# Altium project Kicker_Module_2018.PrjPcb
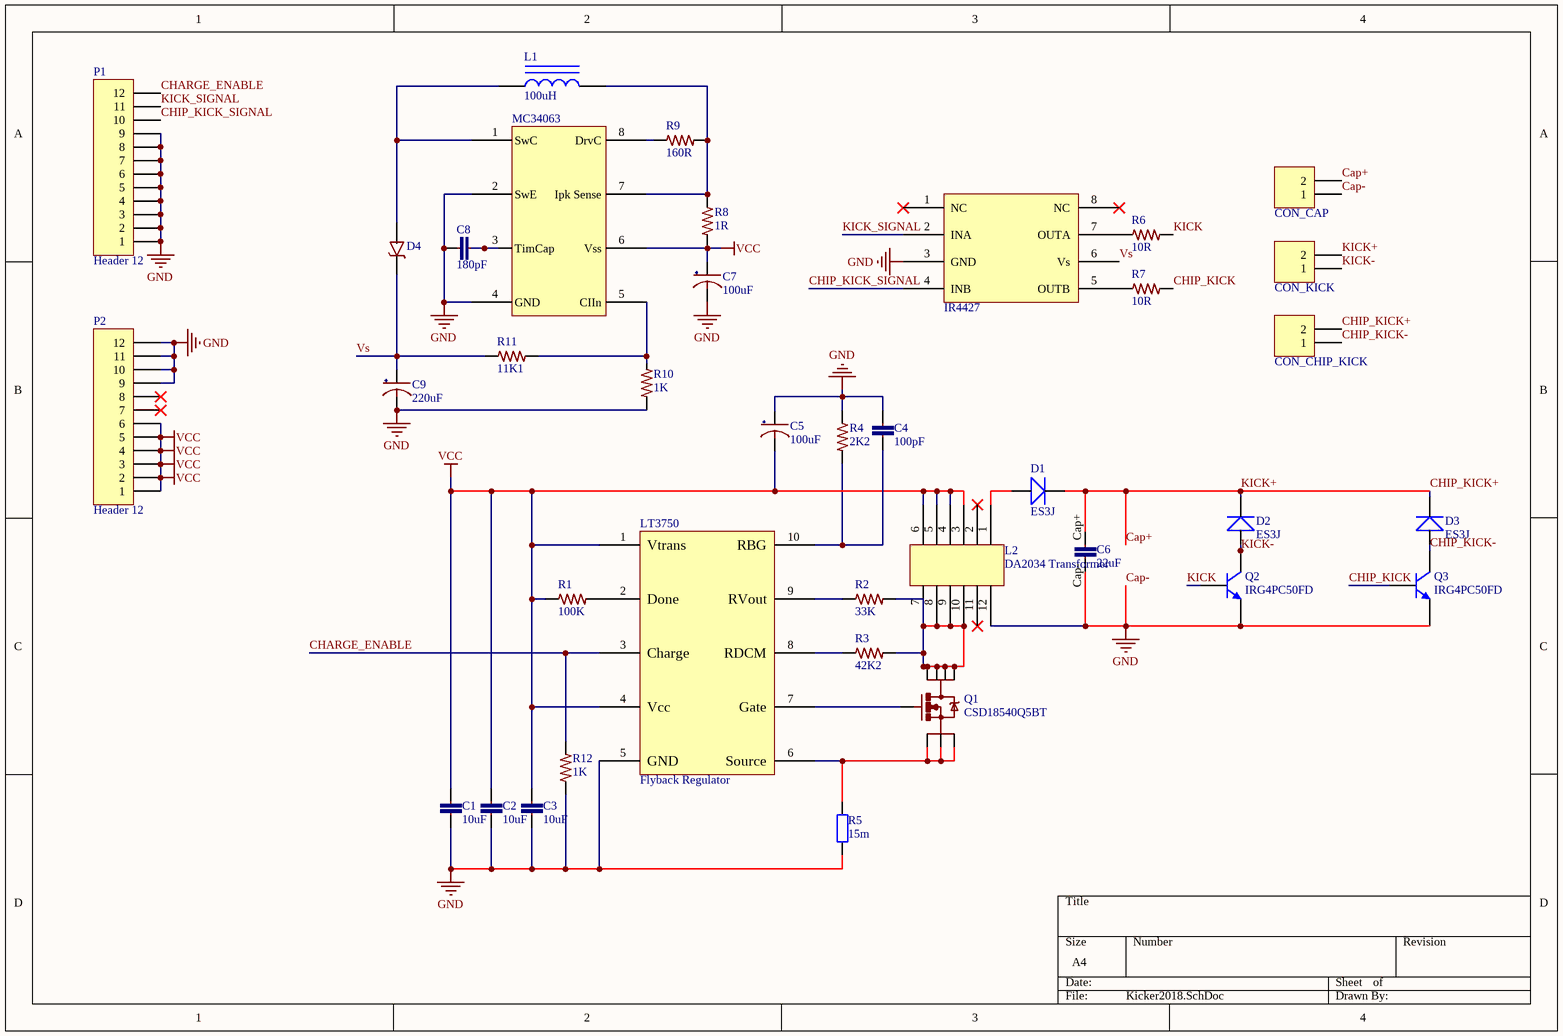
[diagram p0: Kicker2018.SchDoc]
1 sheet, 38 parts. Net scope: global (net labels, ports and power ports of the same name join across sheets).
Board file: Kicker2018_PCB.PcbDoc

## Sheet Kicker2018.SchDoc
size A4

### Parts
C1  10uF  [CAPC0603(1608)55_L]
C2  10uF  [CAPC0603(1608)55_L]
C3  10uF  [CAPC0603(1608)55_L]
C4  100pF  [CAPC0603(1608)55_L]
C5  100uF  [PCBComponent]
C6  22uF  [CAP ALUM 22UF 250V]
C7  100uF  [7343-CAPPOL]
C8  180pF  [0805-CAP]
C9  220uF  [NIC-CAPA2-10X10_V]
CON_CAP  OSTTA024163  [Term Block 2P]  (value not drawn)
CON_CHIP_KICK  OSTTA024163  [Term Block 2P]  (value not drawn)
CON_KICK  OSTTA024163  [Term Block 2P]  (value not drawn)
D1  ES3J  [Diode]
D2  ES3J  [Diode]
D3  ES3J  [Diode]
D4  DIODE SCHOTTKY 60V 30A D2PAK  [DPAK254P1542X460-3N]  (value not drawn)
IR4427  GATE DRIVER  [IR4427]  (value not drawn)
L1  100uH  [INDUCTOR]
L2  DA2034 Transformer  [DA2034 Transformer]
LT3750  Flyback Regulator  [LT3750]
MC34063  Switching Voltage Regulator  [MC34063]  (value not drawn)
P1  Header 12  [HDR1X12]
P2  Header 12  [HDR1X12]
Q1  CSD18540Q5BT  [PCBComponent]
Q2  IRG4PC50FD  [IRG4PC50FD]
Q3  IRG4PC50FD  [IRG4PC50FD]
R1  100K  [0402-RES-HD]
R2  33K  [0402-RES-HD]
R3  42K2  [0402-RES-HD]
R4  2K2  [0402-RES-HD]
R5  15m  [RES1206]
R6  10R  [0402-RES-HD]
R7  10R  [0402-RES-HD]
R8  1R  [0805-RES]
R9  160R  [0805-RES]
R10  1K  [0402-RES-HD]
R11  11K1  [0402-RES-HD]
R12  1K  [0402-RES-HD]

### Nets
Cap-: C1.2 C2.2 C3.2 C4.1 C5.1(+) C6.Cap- C7.2(-) C8.1 C9.2(-) CON_CAP.1 IR4427.3(GND) L2.12 LT3750.5(GND) MC34063.2(SwE) MC34063.4(GND) P1.1 P1.2 P1.3 P1.4 P1.5 P1.6 P1.7 P1.8 P1.9 P2.9 P2.10 P2.11 P2.12 Q2.3(E) Q3.3(E) R4.2 R5.2 R10.1 R12.1  [also labelled GND]
VCC: C1.1 C2.1 C3.1 C5.2(-) C7.1(+) L2.3 L2.4 L2.5 L2.6 LT3750.1(Vtrans) LT3750.4(Vcc) MC34063.6(Vss) P2.1 P2.2 P2.3 P2.4 P2.5 P2.6 R1.1 R8.1
Cap+: C6.Cap+ CON_CAP.2 CON_CHIP_KICK.2 CON_KICK.2 D1.D1+ D2.D1+ D3.D1+  [also labelled CHIP_KICK+, KICK+]
CHARGE_ENABLE: LT3750.3(Charge) P1.12 R12.2
CHIP_KICK: Q3.2(G) R7.2
CHIP_KICK-: CON_CHIP_KICK.1 D3.D1- Q3.1(C)
CHIP_KICK_SIGNAL: IR4427.4(INB) P1.10
KICK: Q2.2(G) R6.2
KICK-: CON_KICK.1 D2.D1- Q2.1(C)
KICK_SIGNAL: IR4427.2(INA) P1.11
Vs: C9.1(+) D4.K IR4427.6(Vs) R11.1
NetC4_2: C4.2 LT3750.10(RBG) R4.1
NetC8_2: C8.2 MC34063.3(TimCap)
NetD1_D1-: D1.D1- L2.1
NetD4_A: D4.A L1.1 MC34063.1(SwC)
NetIR4427_5: IR4427.5(OUTB) R7.1
NetIR4427_7: IR4427.7(OUTA) R6.1
NetL1_2: L1.2 MC34063.7(Ipk_Sense) R8.2 R9.2
NetL2_7: L2.7 L2.8 L2.9 L2.10 Q1.5(D) Q1.6(D) Q1.7(D) Q1.8(D) R2.2 R3.2
NetLT3750_2: LT3750.2(Done) R1.2
NetLT3750_6: LT3750.6(Source) Q1.1(S) Q1.2(S) Q1.3(S) R5.1
NetLT3750_7: LT3750.7(Gate) Q1.4(G)
NetLT3750_8: LT3750.8(RDCM) R3.1
NetLT3750_9: LT3750.9(RVout) R2.1
NetMC34063_5: MC34063.5(CIIn) R10.2 R11.2
NetMC34063_8: MC34063.8(DrvC) R9.1

Not connected (* = marked no-connect by the designer): IR4427 1(NC)* 8(NC)*; L2 2* 11*; P2 7* 8*

### Library data of the parts
C1-C3 = C0603-10uF-16V-1: CAP CER 10UF 16V X5R 0603; Part No: EMK107BBJ106MA-T; Cod EMS: 05.281.019.592; Value: 10uF
C4 = CC0603--1: CAP CER 100PF 50V NP0 0603; Part No: GRM1885C1H101JA01D; Value: 100pF
C5 = CA-100uF-3: CAP ALUM 100UF 20% 80V SMD
C6 = CAP ALUM 22UF 250V
C7 = CT2917-100uF-1: CAP TANT 100uF 25V 20% ESR = 30mOhm @ 100 kHz; Part No: T521X107M025ATE030
C8 = CC0805-180pF-2: CAP CER 180PF 50V NP0 0805; Part No: C0805C181K5GACTU; Cod EMS: 05.281.019.399; Value: 180pF
C9 = CA-220uF-1: CAP ALUM 220uF 20% 50V  ESR = 0,18 ohms  Radial DIA 10mm HEIGH 10,2mm; Part No: EEEFK1H221P; Cod EMS: 05.281.030.094; Value: 220uF
CON_CAP CON_CHIP_KICK CON_KICK = Term Block 2P: 2 Position Wire to Board Terminal Block Horizontal with Board 0.200" (5.08mm) Through Hole
D4 = STPS30M60SG-TR-1: Part No: STPS30M60SG-TR
IR4427 = IR4427: IC DRIVER DUAL LOW SIDE 8-SOIC
L1 = Inductor: Fixed Inductors 100uH 0.86A SMT
LT3750 = LT3750
MC34063 = MC34063
P1 P2 = Header 12: Header, 12-Pin; LatestRevisionDate: 17-Jul-2002; LatestRevisionNote: Re-released for DXP Platform.; Publisher: Altium Limited
Q1 = CSD18540Q5BT-1: MOSFET N-CH 60V 100A 8VSON; Part No: CSD18540Q5BT
Q2 Q3 = IRG4PC50FD: IGBT Transistors 600V FAST 1-8 KHZ COPACK IGBT; Published: 28-dez-2017; DatasheetVersion: 2000; Publisher: RoboIME; ComponentLink2URL: http://www.irf.com/product-info/datasheets/data/irg4pc50fd.pdf
R1 = R0402-100K-11: RES 100K OHM 1/10W 1% 0402 SMD 1; Part No: ERJ-2GEJ104X; Cod EMS: 05.280.029.504; Family Description: RESISTOR FILME ESPESSO 0R-1M / 1/10W / 5% /  0402. P/N: ERJ-2GE....X – PANASONIC ELECTRONIC COMPONENTS.; Family: ERJ-2GE....X; Value: 100k
R2 = R0402-33K-7: RES 33K OHM 1/10W 1% 0402 SMD; Part No: ERJ-2RKF3302X; Cod EMS: 05.280.029.535; Family Description: RESISTOR FILME ESPESSO 10R-1M / 1/10W / 1% / 0402. P/N: ERJ-2RKF....X – PANASONIC ELECTRONIC COMPONENTS.; Value: 33K; Family: ERJ-2RKF....X
R3 = RESISTOR: RES 42.2K OHM 1/10W 1% 0402 SMD; Part No: ERJ-2RKF4222X; Value: 42.2K
R4 = R0402-2K2-5: RES 2.2K OHM 1/10W 1% 0402 SMD; Part No: ERJ-2RKF2201X; Cod EMS: 05.280.029.541; Family Description: RESISTOR FILME ESPESSO 10R-1M / 1/10W / 1% / 0402. P/N: ERJ-2RKF....X – PANASONIC ELECTRONIC COMPONENTS.; Value: 2.2K; Family: ERJ-2RKF....X
R5 = Res2: Resistor; Published: 8-Jun-2000; LatestRevisionDate: 17-Jul-2002; LatestRevisionNote: Re-released for DXP Platform.; PackageReference: AXIAL-0.4; Publisher: Altium Limited; PackageDescription: Axial Device, Thru-Hole; 2 Leads; 0.4 in Pin Spacing; Value: 15m
R6 R7 = R0402-10R-6: RES 10 OHM 1/10W 1% 0402 SMD; Part No: ERJ-2RKF10R0X; Cod EMS: 05.280.029.523; Value: 10; Family Description: RESISTOR FILME ESPESSO 10R-1M / 1/10W / 1% / 0402. P/N: ERJ-2RKF....X – PANASONIC ELECTRONIC COMPONENTS.; Family: ERJ-2RKF....X
R8 = R0805-1R-1%-1: RES SMD 1 OHM 1% 1/8W 0805; Part No: CRCW08051R00FKEA; Cod EMS: 05.280.029.391; Value: 1R
R9 = R0805-160R-5: RES 160 OHM 1/8W .5% 0805 SMD; Part No: ERA-6AED161V; Cod EMS: 05.280.029.516; Value: 160; Family: ERA-6AED...V
R10 R12 = R0402-1K-A.9: RES 1K OHM 1/10W 1% 0402 SMD; Part No: ERJ-2RKF1001X; Cod EMS: 05.280.029.527; Family Description: RESISTOR FILME ESPESSO 10R-1M / 1/10W / 1% / 0402. P/N: ERJ-2RKF....X – PANASONIC ELECTRONIC COMPONENTS.; Value: 1K; Family: ERJ-2RKF....X
R11 = R0402-11K1-1: RES 11.1 KOHM 1/16W 0.1% 0402 SMD; Part No: TNPW040211K1BEED; Value: 11k1